# EAGLE design led_driver_board (EAGLE 5.11)
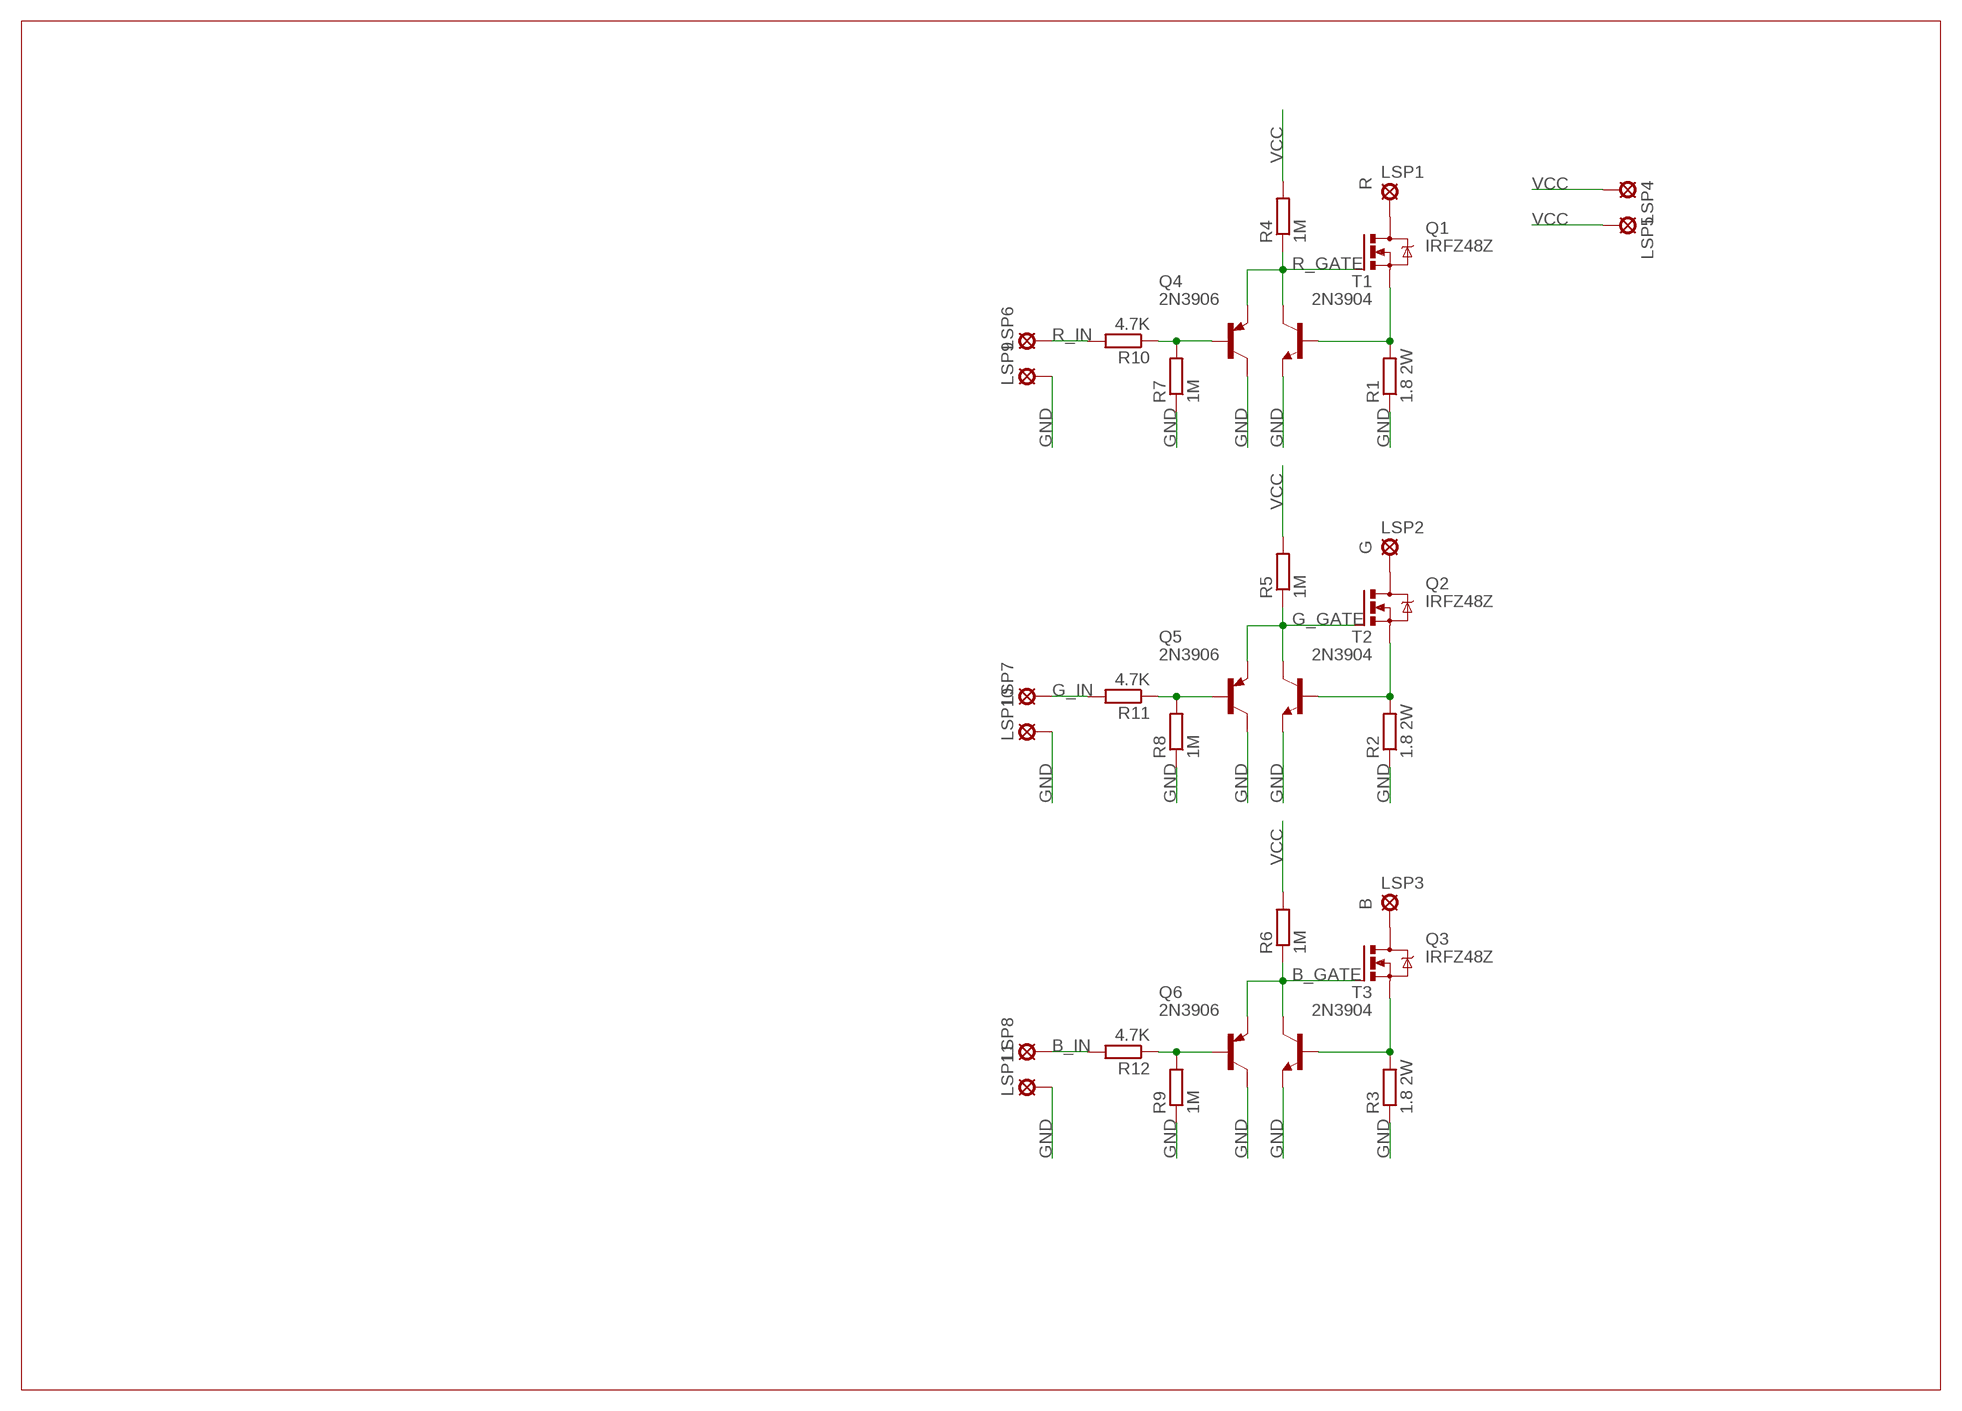
[diagram p0: schematic, sheet 1]

## Parts
LSP1  LSP10  [LSP10]
LSP2  LSP10  [LSP10]
LSP3  LSP10  [LSP10]
LSP4  LSP10  [LSP10]
LSP5  LSP10  [LSP10]
LSP6  LSP10  [LSP10]
LSP7  LSP10  [LSP10]
LSP8  LSP10  [LSP10]
LSP9  LSP10  [LSP10]
LSP10  LSP10  [LSP10]
LSP11  LSP10  [LSP10]
Q1  IRFZ48Z  [TO220BH]
Q2  IRFZ48Z  [TO220BH]
Q3  IRFZ48Z  [TO220BH]
Q4  2N3906  [TO92]
Q5  2N3906  [TO92]
Q6  2N3906  [TO92]
R1  1.8 2W  R-EU_0207/2V  [0207/2V]
R2  1.8 2W  R-EU_0207/2V  [0207/2V]
R3  1.8 2W  R-EU_0207/2V  [0207/2V]
R4  1M  R-EU_0207/7  [0207/7]
R5  1M  R-EU_0207/7  [0207/7]
R6  1M  R-EU_0207/7  [0207/7]
R7  1M  R-EU_0207/2V  [0207/2V]
R8  1M  R-EU_0207/2V  [0207/2V]
R9  1M  R-EU_0207/2V  [0207/2V]
R10  4.7K  R-EU_0207/2V  [0207/2V]
R11  4.7K  R-EU_0207/2V  [0207/2V]
R12  4.7K  R-EU_0207/2V  [0207/2V]
T1  2N3904  [TO92]
T2  2N3904  [TO92]
T3  2N3904  [TO92]

## Nets
B: LSP3.MP Q3.D
B_GATE: Q3.G Q6.3(E) R6.1 T3.1(C)
B_IN: LSP8.MP R12.2
G: LSP2.MP Q2.D
G_GATE: Q2.G Q5.3(E) R5.1 T2.1(C)
G_IN: LSP7.MP R11.2
GND: LSP9.MP LSP10.MP LSP11.MP Q4.1(C) Q5.1(C) Q6.1(C) R1.1 R2.1 R3.1 R7.1 R8.1 R9.1 T1.3(E) T2.3(E) T3.3(E)
N$4: Q1.S R1.2 T1.2(B)
N$5: Q2.S R2.2 T2.2(B)
N$6: Q3.S R3.2 T3.2(B)
N$11: Q6.2(B) R9.2 R12.1
N$12: Q5.2(B) R8.2 R11.1
N$15: Q4.2(B) R7.2 R10.1
R: LSP1.MP Q1.D
R_GATE: Q1.G Q4.3(E) R4.1 T1.1(C)
R_IN: LSP6.MP R10.2
VCC: LSP4.MP LSP5.MP R4.2 R5.2 R6.2

## Library data of the parts
LSP1-LSP11 = solpad:LSP10: SOLDER PAD drill 1.0 mm, distributor Buerklin, 12H555
Q1-Q3 = transistor-power:IRFZ48: N Channel HEXFET® Power MOSFET Logic Level Source: http://www.irf.com/product-info/datasheets/data/irfz48z.pdf
Q4-Q6 = transistor-pnp:2N3906: PNP Transistor
R1-R12 = resistor:R-EU_: RESISTOR, European symbol
T1-T3 = transistor:2N3904: NPN TRANSISTOR

## Board
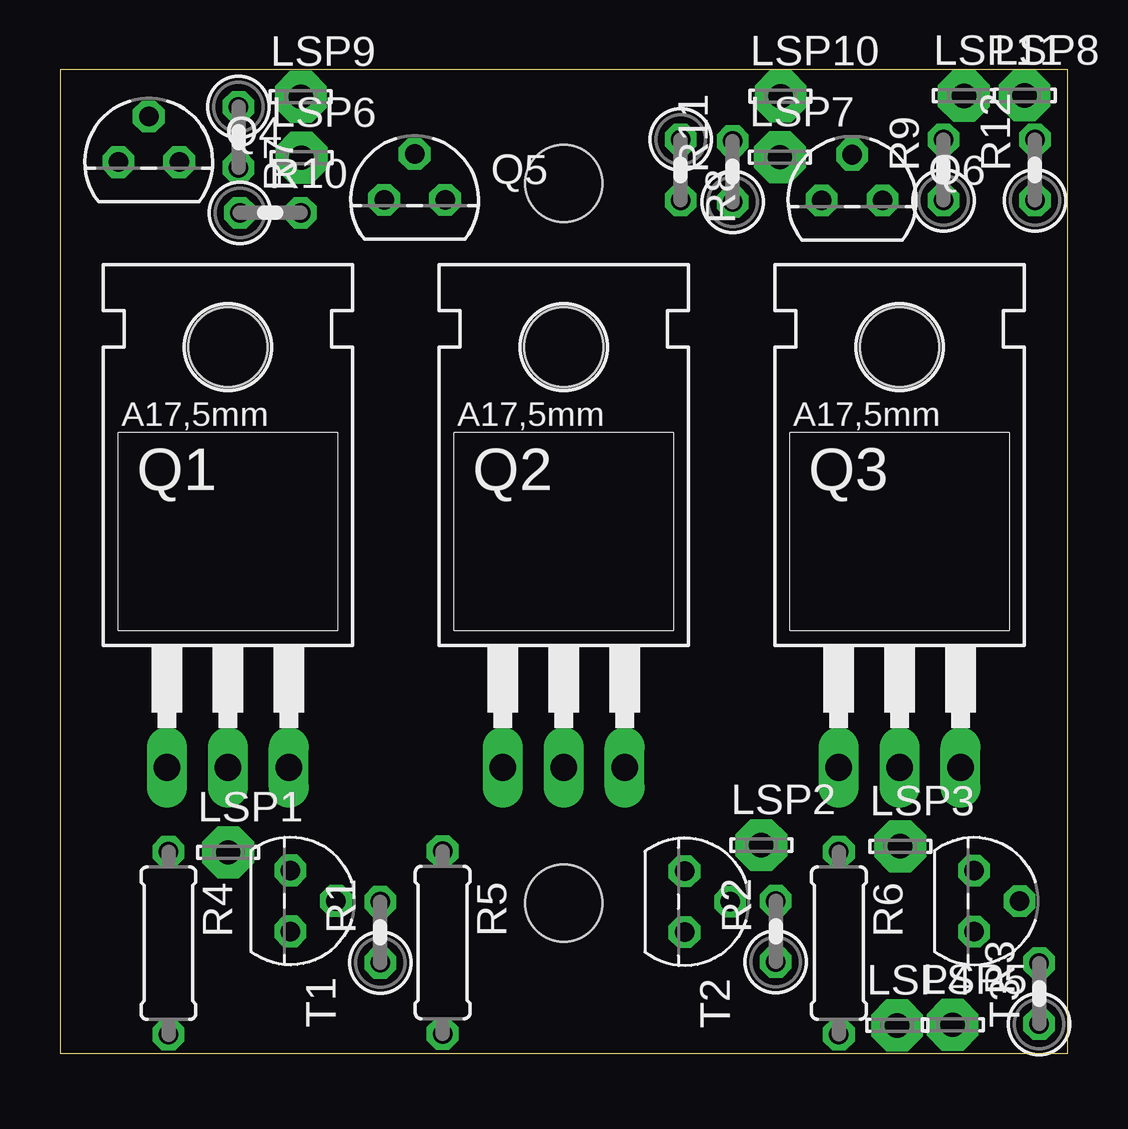
[diagram p1: board, top side]
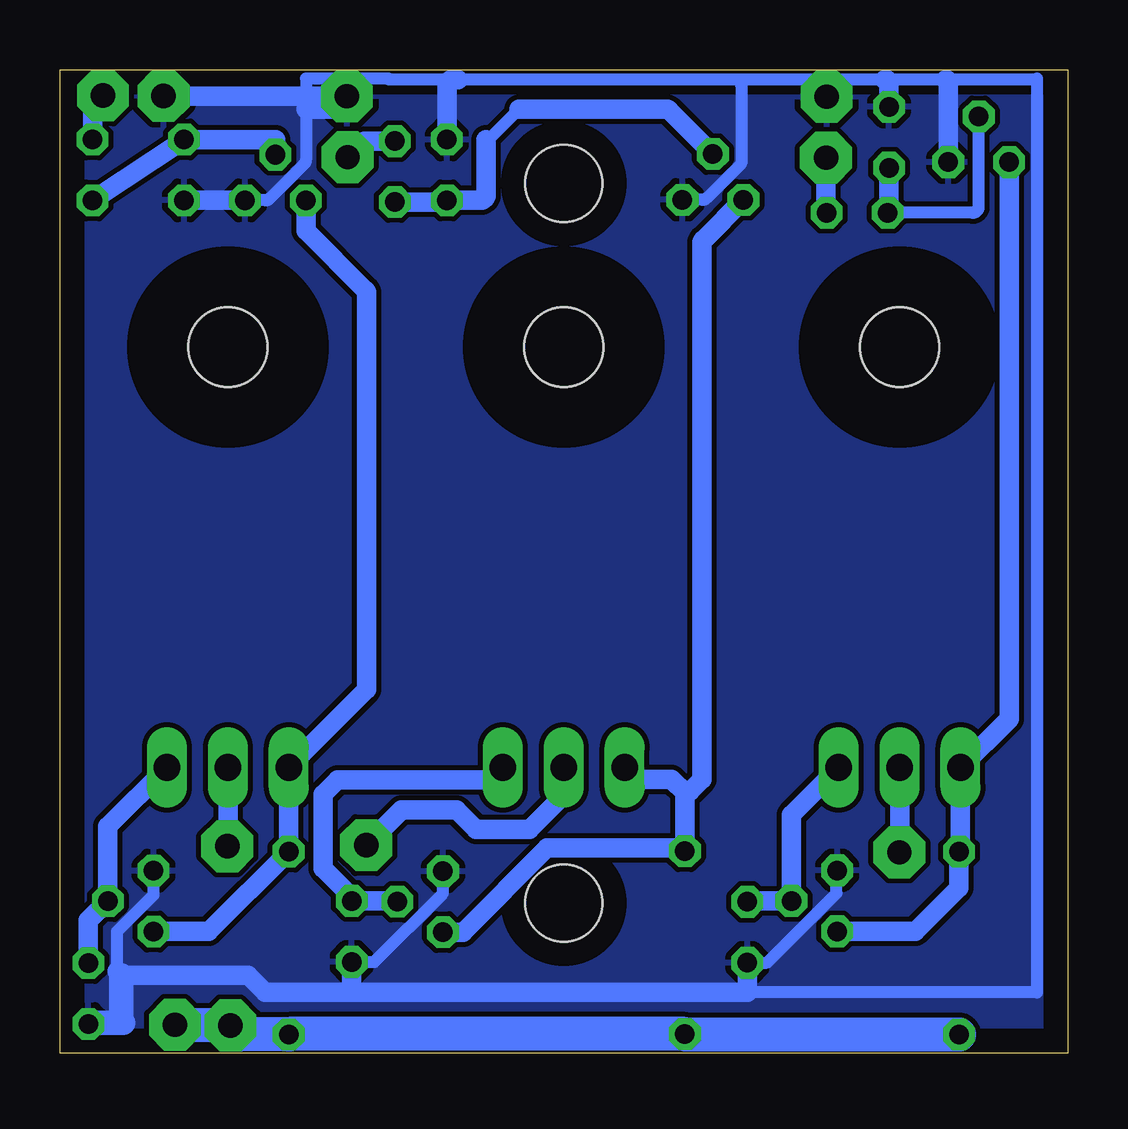
[diagram p2: board, bottom side, seen from below]

Size 42 x 41 mm. Coordinates in mm from the lower left corner, seen from the top.
Outline: 0,0 42,0 42,41 0,41 0,0
Copper layers (1*16): Top 0.035mm / dielectric 1.5mm / Bottom 0.035mm
Design rules "default": minimum track width 10mil, minimum drill 24mil, track to track 8mil, track to pad 8mil, pad to pad 8mil, via to via 8mil, smd to smd 8mil, copper to edge 40mil, drill to drill 8mil, minimum pad ring 10mil, minimum via ring 8mil, stop-mask expansion 4mil, vias tented up to drill 0mil, thermal gap 10mil
Holes 3.2 mm at 21,6.27 21,36.27

### Footprints (pad centres in the part's own frame; a part is rotated, then mirrored left to right if it is on the bottom)
LSP10 = drill 1.016 pad 2.159 octagon: MP 0,0
TO220BH = drill 1.118 long: D 0,-6.35; G -2.54,-6.35; S 2.54,-6.35 | hole 3.302: 0,11.176
TO92 = drill 0.813 octagon: 1 1.27,0; 2 0,1.905; 3 -1.27,0
0207/2V = drill 0.813 octagon: 1 -1.27,0; 2 1.27,0
0207/7 = drill 0.813 octagon: 1 -3.81,0; 2 3.81,0

### Placement (x,y rotation side)
LSP1  7.01,8.38 0 top
LSP2  29.24,8.69 0 top
LSP3  35.03,8.64 0 top
LSP4  34.9,1.17 0 top
LSP5  37.21,1.19 0 top
LSP6  10.07,37.34 0 top
LSP7  30.01,37.36 0 top
LSP8  40.21,39.93 0 top
LSP9  10.04,39.88 0 top
LSP10  30.04,39.9 0 top
LSP11  37.68,39.92 0 top
Q1  7,18.27 0 top
Q2  21,18.27 0 top
Q3  35,18.27 0 top
Q4  3.7,37.16 0 top
Q5  14.78,35.59 0 top
Q6  33.02,35.56 0 top
R1  13.35,5.05 90 top
R2  29.84,5.09 90 top
R3  40.82,2.5 90 top
R4  4.52,4.6 270 top
R5  15.95,4.62 270 top
R6  32.47,4.6 270 top
R7  7.44,38.19 270 top
R8  25.87,36.83 270 top
R9  36.83,36.83 90 top
R10  8.77,35.04 0 top
R11  28.04,36.76 90 top
R12  40.64,36.83 90 top
T1  9.6,6.36 270 top
T2  26.04,6.32 270 top
T3  38.1,6.35 270 top

### Tracks (layer width: path | path; a pad name or v marks a point on that pad's centre or on a via)
B
  Bottom 0.813: LSP3.MP 35,8.64 Q3.D
B_GATE
  Bottom 0.813: T3.1 35.8,5.08 R6.1 Q3.G 29.21,15.17 29.21,31.64 arc-45 29.28,31.82 31.75,34.29 Q6.3
B_IN
  Bottom 0.813: LSP8.MP 40.57,39.57 arc-45 40.64,39.4 R12.2
G
  Bottom 0.813: LSP2.MP 27.76,10.16 25.48,10.16 24.66,9.35 22.43,9.35 21,10.78 Q2.D
G_GATE
  Bottom 0.813: 15.95,10.87 R5.1 16.08,8.56 21.69,8.56 25.2,5.05 T2.1 | 15.95,10.87 16.51,11.43 17.97,11.43 Q2.G | Q5.3 15.17,33.93 arc-45 15.24,33.75 15.24,11.43 15.72,10.95 arc45 15.9,10.87 15.95,10.87
G_IN
  Bottom 0.813: LSP7.MP 29.41,37.96 arc45 29.23,38.03 R11.2
GND
  Bottom 0.508: R2.1 28.9,3.82 26.04,6.68 T2.3 | R1.1 12.53,3.78 9.63,6.68 9.63,7.6 T1.3 | T3.3 38.1,6.6 39.62,5.08 39.62,3.43 | 13.35,2.54 1.27,2.54 1.27,40.64 arc45 1.37,40.6 5.08,40.6 7.62,40.6 10.16,40.6 13.85,40.6 | Q6.1 33.45,35.56 arc-45 33.27,35.63 31.82,37.08 arc-45 31.75,37.26 31.75,39.37 31.75,40.64 28.34,40.64 arc90 28.3,40.6 25.4,40.6 13.85,40.6 | Q5.1 15.22,35.59 arc-45 15.04,35.66 13.6,37.1 13.6,40.35 arc-90 13.85,40.6
  Bottom 0.813: 29.84,2.54 R2.1 | R1.1 13.35,2.54 29.84,2.54 | 29.84,2.54 33.45,2.54 34.16,3.25 39.45,3.25 39.62,3.43 | Q6.1 R9.1 | Q4.1 4.97,40.49 arc-90 5.08,40.6 | R7.1 7.44,40.42 arc-90 7.62,40.6 | R8.1 25.87,40.35 arc90 25.62,40.6 25.4,40.6 | LSP9.MP 10.04,40.38 arc-45 10.11,40.55 10.16,40.6 | 31.75,39.37 30.68,39.37 arc-45 30.5,39.44 LSP10.MP 37.63,39.9 arc45 LSP11.MP
  Bottom 1.016: R3.1 40.77,1.27 39.37,1.27 39.45,1.35 39.45,3.25
  pour Bottom: 0,0 42,0 42,41 0,41
N$4
  Bottom 0.813: Q1.S 11.51,9.95 T1.2 13.31,6.36 R1.2
N$5
  Bottom 0.813: T2.2 27.97,6.36 R2.2 29.84,6.52 31.04,7.72 31.04,10.79 30.43,11.4 24.05,11.4 Q2.S
N$6
  Bottom 0.813: R3.2 40.82,5.54 T3.2 40.01,9.46 Q3.S
N$11
  Bottom 0.813: Q6.2 33.02,38.1 R9.2 R12.1
N$12
  Bottom 0.508: 24.23,38.1 arc-45 24.06,38.17 22.86,39.37
  Bottom 0.813: 22.86,39.37 16.77,39.37 arc45 16.59,39.3 Q5.2 | 24.23,38.1 24.23,35.81 arc90 24.49,35.56 R8.2 arc45 26.04,35.49 R11.1
N$15
  Bottom 0.508: Q4.2 3.7,35.3 arc90 3.96,35.04 R10.1
  Bottom 0.813: R7.2 7.44,35.1 arc90 R10.1
R
  Bottom 0.813: Q1.D 7,8.39 LSP1.MP
R_GATE
  Bottom 0.813: T1.1 6.34,5.09 4.52,6.91 R4.1 4.46,8.47 Q1.G 2.43,13.95 Q4.3
R_IN
  Bottom 0.813: LSP6.MP 10.07,35.13 arc-45 R10.2
VCC
  Bottom 1.422: R4.2 15.93,0.79 R5.2 32.45,0.81 R6.2 34.52,0.79 LSP4.MP 37.19,1.17 LSP5.MP

### Text on the board
tDocu: E | B | C | E | E | B | C | C | C